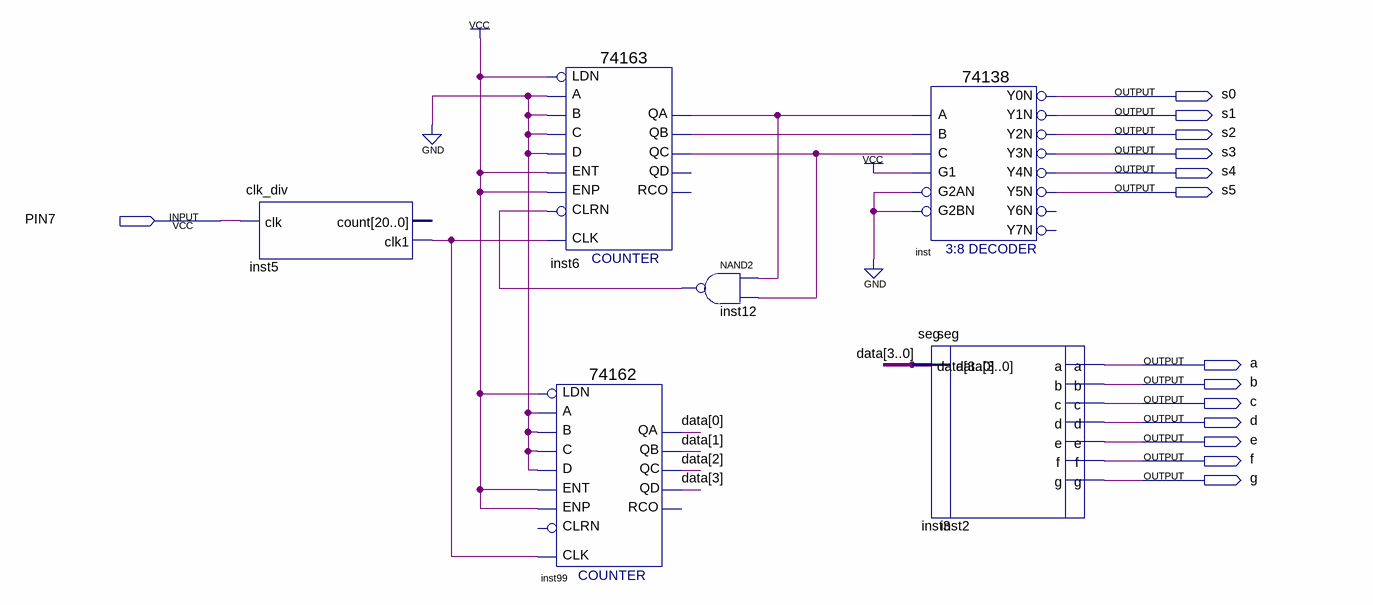
[diagram p0: schematic sheet]
// Quartus schematic lab10.bdf as structural Verilog: 7 symbols, 14 pins
module lab10 (
  input  PIN7,
  output s0,
  output s1,
  output s2,
  output s3,
  output s4,
  output s5,
  output a,
  output b,
  output c,
  output d,
  output e,
  output f,
  output g
);

  wire inst5_clk1, inst6_qa, inst6_qb, inst6_qc, inst12_out;
  wire [3:0] data;

  clk_div inst5 (.clk(PIN7), .clk1(inst5_clk1));  // open: count
  \74163  inst6 (
    .C(1'b0), .B(1'b0), .A(1'b0), .ENT(1'b1), .D(1'b0), .CLRN(inst12_out), .CLK(inst5_clk1), .ENP(1'b1),
    .LDN(1'b1), .QA(inst6_qa), .QB(inst6_qb), .QC(inst6_qc));  // open: QD, RCO
  \74162  inst99 (
    .A(1'b0), .LDN(1'b1), .B(1'b0), .C(1'b0), .D(1'b0), .ENP(1'b1), .ENT(1'b1), .CLK(inst5_clk1),
    .QA(data[0]), .QB(data[1]), .QC(data[2]), .QD(data[3]));  // open: CLRN, RCO
  nand inst12 (inst12_out, inst6_qa, inst6_qc);
  \74138  inst (
    .A(inst6_qa), .B(inst6_qb), .G1(1'b1), .C(inst6_qc), .G2AN(1'b0), .G2BN(1'b0), .Y0N(s0), .Y1N(s1),
    .Y2N(s2), .Y3N(s3), .Y4N(s4), .Y5N(s5));  // open: Y6N, Y7N
  seg inst3 (.data(data));  // open: a, b, c, d, e, f, g
  seg inst2 (.data(data), .a(a), .b(b), .c(c), .d(d), .e(e), .f(f), .g(g));
endmodule
